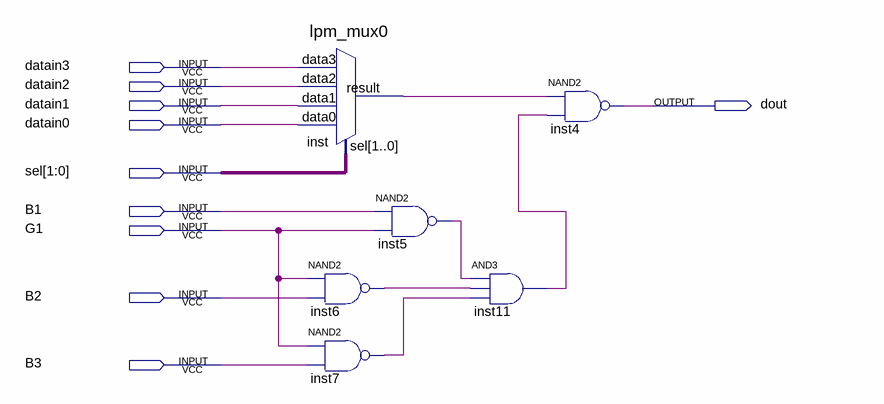
[diagram p0: schematic sheet]
// Quartus schematic sch_exam.bdf as structural Verilog: 6 symbols, 10 pins
module sch_exam (
  input  datain3,
  input  datain2,
  input  datain1,
  input  datain0,
  input  [1:0] sel,
  input  B1,
  input  G1,
  input  B2,
  input  B3,
  output dout
);

  wire inst5_out, inst6_out, inst7_out, inst11_out, inst_result;

  lpm_mux0 inst (.data3(datain3), .data2(datain2), .data1(datain1), .data0(datain0), .sel(sel), .result(inst_result));
  nand inst6 (inst6_out, G1, B2);
  nand inst7 (inst7_out, G1, B3);
  nand inst5 (inst5_out, B1, G1);
  and inst11 (inst11_out, inst5_out, inst6_out, inst7_out);
  nand inst4 (dout, inst_result, inst11_out);
endmodule
